# Altium schematic sheet Motor_Driver.SchDoc
size A4; Organization1: VINCULADA AO EXÉRCITO BRASILEIRO; Organization2: FÁBRICA DE MATERIAL DE; Organization3: COMUNICAÇÕES E ELETRÔNICA; Organization0: INDÚSTRIA DE MATERIAL BÉLICO DO BRASIL
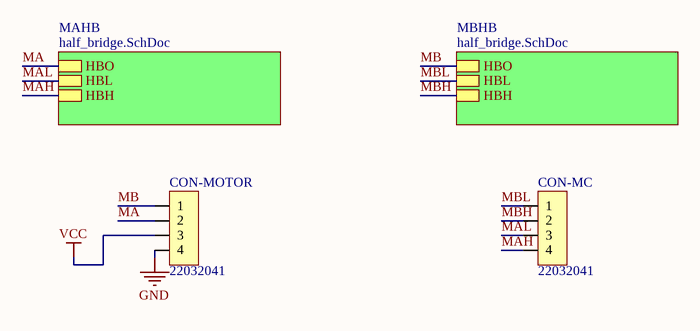
[diagram p0: Motor_Driver.SchDoc]

## Parts
CON-MC  22032041  [04x01_Conector_Male]
CON-MOTOR  22032041  [04x01_Conector_Male]

## Sub-sheets
MAHB = half_bridge.SchDoc: HBO, HBL, HBH
MBHB = half_bridge.SchDoc: HBO, HBL, HBH

## Nets
GND: CON-MOTOR.4
VCC: CON-MOTOR.3
MA: CON-MOTOR.2 ; sheet MAHB/HBO
MAH: CON-MC.4 ; sheet MAHB/HBH
MAL: CON-MC.3 ; sheet MAHB/HBL
MB: CON-MOTOR.1 ; sheet MBHB/HBO
MBH: CON-MC.2 ; sheet MBHB/HBH
MBL: CON-MC.1 ; sheet MBHB/HBL

## Notes on the sheet
- USADO EQUIP.:
- DATA:
- ENG:
- HORA:
- APROV._______
- REV:
- TÍTULO:
- FOLHA:
- /
- FORMATO:
- A4
- CÓDIGO:
- ESTOQUE:

## Library data of the parts
CON-MC CON-MOTOR = 04x01_Conector_Male-SCH: CONN HEADER 4POS .100 VERT TIN